# EAGLE schematic schema (EAGLE 9.4.2)
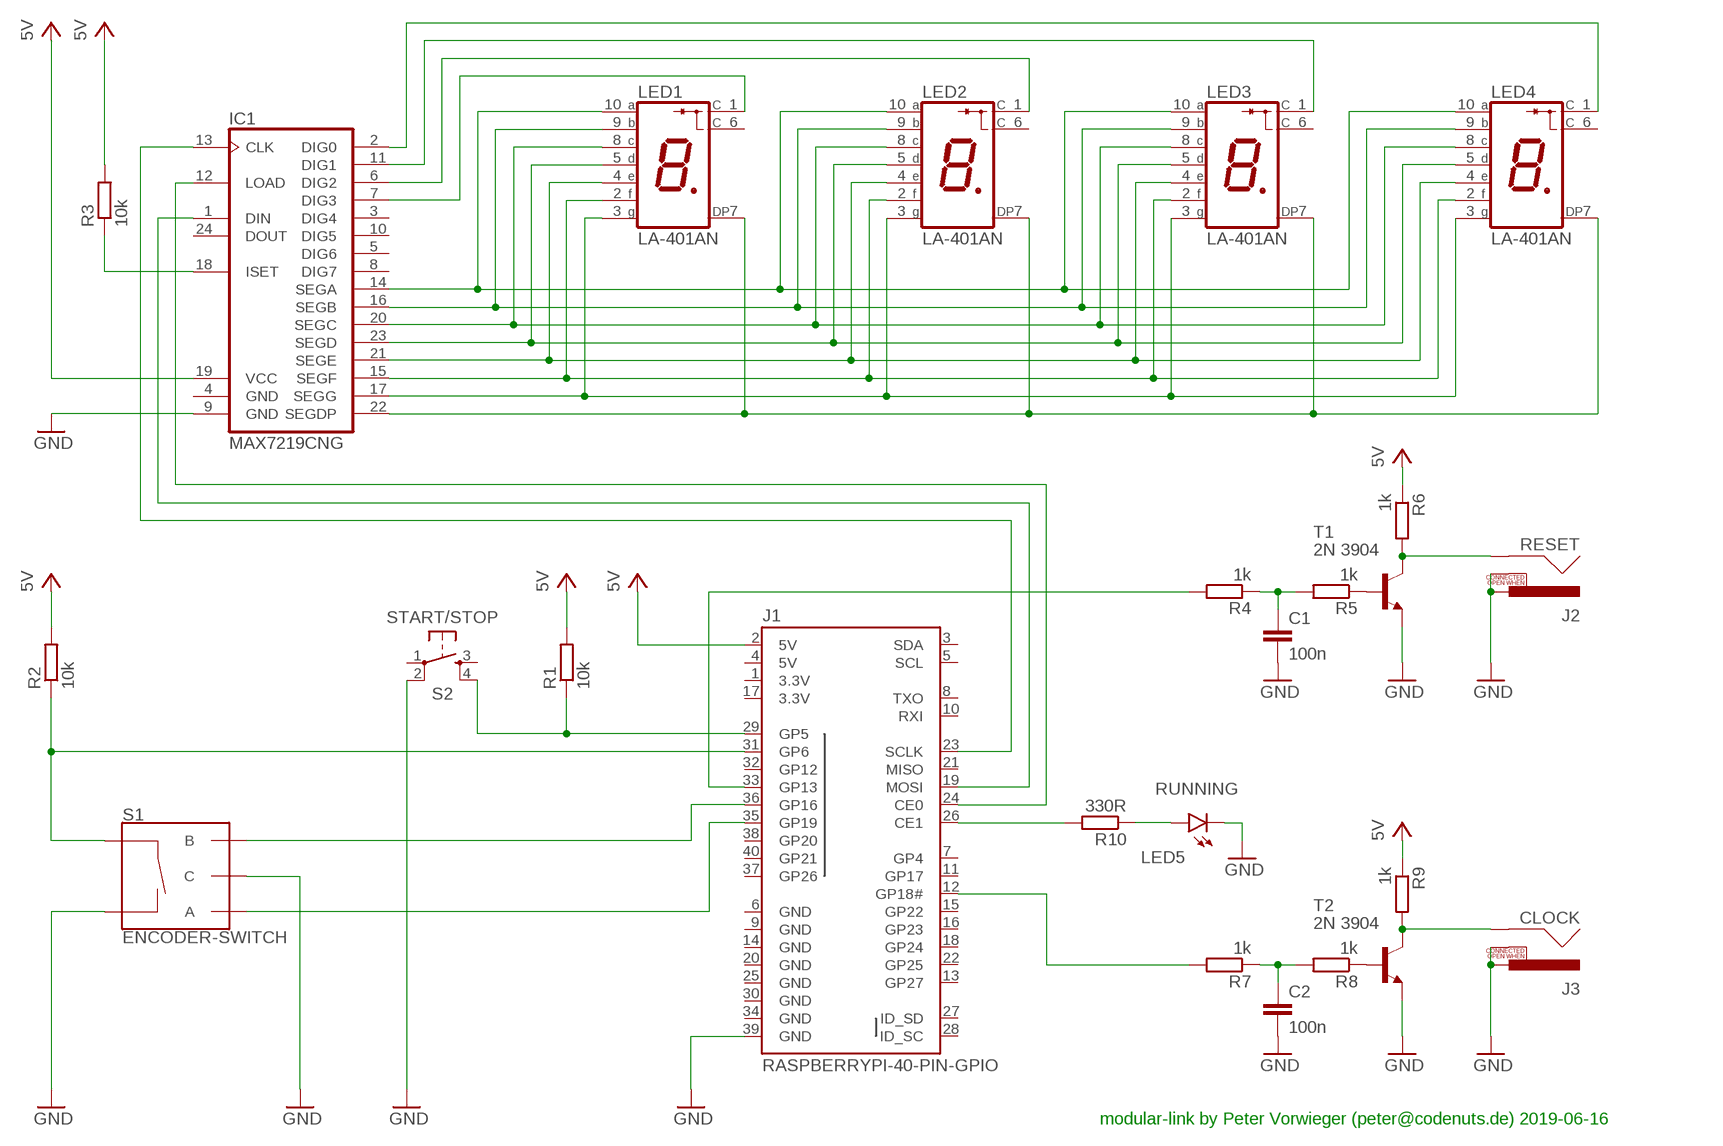
[diagram p0: schematic, sheet 1]

## Parts
C1  100n  C-EU025-024X044  [C025-024X044]
C2  100n  C-EU025-024X044  [C025-024X044]
IC1  MAX7219CNG  [DIL24-3]
J1  RASPBERRYPI-40-PIN-GPIO  RASPBERRYPI-40-PIN-GPIO_PTH_NO_SHROUD  [2X20]
J2  RESET  RCA  [RCA]
J3  CLOCK  RCA  [RCA]
LED1  LA-401AN  [LA-401]
LED2  LA-401AN  [LA-401]
LED3  LA-401AN  [LA-401]
LED4  LA-401AN  [LA-401]
LED5  RUNNING  LEDTOPLED-SANTANA  [MINI-TOPLED-SANTANA]
R1  10k  R-EU_0204/5  [0204/5]
R2  10k  R-EU_0204/5  [0204/5]
R3  10k  R-EU_0204/5  [0204/5]
R4  1k  R-EU_0204/5  [0204/5]
R5  1k  R-EU_0204/5  [0204/5]
R6  1k  R-EU_0204/5  [0204/5]
R7  1k  R-EU_0204/5  [0204/5]
R8  1k  R-EU_0204/5  [0204/5]
R9  1k  R-EU_0204/5  [0204/5]
R10  330R  R-EU_0204/5  [0204/5]
S1  ENCODER-SWITCH  [ROTARY_ENC_PLAIN]
S2  START/STOP  MOMENTARY-SWITCH-SPST-2-SMD-5.2MM  [TACTILE_SWITCH_SMD_5.2MM]
T1  2N 3904  -NPN-TO92-EBC  [TO92-EBC]
T2  2N 3904  -NPN-TO92-EBC  [TO92-EBC]

## Nets
GND: C1.2 C2.2 IC1.9(GND) J1.39(GND) J2.PIN J2.SWITCH J3.PIN J3.SWITCH LED5.C S1.C S1.SW- S2.2 T1.E T2.E
N$1: J1.31(GP6) R2.1 S1.SW+
N$2: IC1.14(SEGA) LED1.10(A) LED2.10(A) LED3.10(A) LED4.10(A)
N$3: IC1.16(SEGB) LED1.9(B) LED2.9(B) LED3.9(B) LED4.9(B)
N$4: IC1.20(SEGC) LED1.8(C) LED2.8(C) LED3.8(C) LED4.8(C)
N$5: IC1.23(SEGD) LED1.5(D) LED2.5(D) LED3.5(D) LED4.5(D)
N$6: IC1.22(SEGDP) LED1.7(DP) LED2.7(DP) LED3.7(DP) LED4.7(DP)
N$7: IC1.7(DIG3) LED1.1(C)
N$8: J1.35(GP19) S1.A
N$9: IC1.11(DIG1) LED3.1(C)
N$10: IC1.2(DIG0) LED4.1(C)
N$11: IC1.6(DIG2) LED2.1(C)
N$12: J1.29(GP5) R1.1 S2.4
N$13: IC1.21(SEGE) LED1.4(E) LED2.4(E) LED3.4(E) LED4.4(E)
N$14: IC1.15(SEGF) LED1.2(F) LED2.2(F) LED3.2(F) LED4.2(F)
N$15: J1.36(GP16) S1.B
N$16: J1.26(CE1) R10.2
N$17: IC1.17(SEGG) LED1.3(G) LED2.3(G) LED3.3(G) LED4.3(G)
N$18: IC1.18(ISET) R3.1
N$19: IC1.1(DIN) J1.19(MOSI)
N$20: IC1.12(LOAD) J1.24(CE0)
N$21: IC1.13(CLK) J1.23(SCLK)
N$22: J1.12(GP18#) R7.2
N$23: J1.33(GP13) R4.2
N$24: R5.1 T1.B
N$25: J2.SHELL R6.2 T1.C
N$26: C1.1 R4.1 R5.2
N$27: C2.1 R7.1 R8.2
N$28: R8.1 T2.B
N$29: J3.SHELL R9.2 T2.C
N$30: LED5.A R10.1
VCC: IC1.19(VCC) J1.2(5V) R1.2 R2.2 R3.2 R6.1 R9.1 ; supply symbol labelled 5V
Unconnected: IC1.3(DIG4) IC1.5(DIG6) IC1.8(DIG7) IC1.10(DIG5) IC1.24(DOUT) J1.3(SDA) J1.5(SCL) J1.7(GP4) J1.8(TXO) J1.10(RXI) J1.11(GP17) J1.13(GP27) J1.15(GP22) J1.16(GP23) J1.18(GP24) J1.21(MISO) J1.22(GP25) J1.27(ID_SD) J1.28(ID_SC) J1.32(GP12) J1.37(GP26) J1.38(GP20) J1.40(GP21) LED1.6(C) LED2.6(C) LED3.6(C) LED4.6(C) S2.1 S2.3

## Notes on the sheet
- modular-link by Peter Vorwieger (peter@codenuts.de) 2019-06-16

## Power pins joined to a net without a drawn wire
3.3V: J1.1(3.3V) J1.17(3.3V)
5V: J1.4(5V)
GND: IC1.4(GND) J1.6(GND) J1.9(GND) J1.14(GND) J1.20(GND) J1.25(GND) J1.30(GND) J1.34(GND)

## Library data of the parts
C1 C2 = rcl:C-EU: CAPACITOR, European symbol; SPICEPREFIX: C
IC1 = max7219:MAX7219CNG: LED DISPLAY DRIVER; MF: MAXIM; MPN: MAX7219CNG; OC_FARNELL: 1523914; OC_NEWARK: 34C4018
J1 = SparkFun-Connectors:RASPBERRYPI-40-PIN-GPIO: Raspberry Pi GPIO Header 2x20 pin connector, as found on B, B+, A+ models. Both shrouded PTH and SMT versions available. SparkFun Products: GPIO Shrouded Header <https://www.sparkfun.com/products/13054>- PTH SparkFun Pi Wedge (Preassembled) <https://www.sparkfun.com/products/13717>
J2 J3 = SparkFun-Connectors:RCA: RCA Jack connector This is a right angle RCA jack connecotr. Commonly used for video or audio. Here is the connector we sell at SparkFun: RCA Jack <https://www.sparkfun.com/products/8631> (PRT-08631) Datasheet <http://www.sparkfun.com/datasheets/Prototyping/Connectors/RCA-Jack.pdf> It is not used on any active designs, however it was used on a couple retired products: RCA Jack Breakout [RETIRED] <https://www.sparkfun.com/products/8826> (PRT-08826) SparkFun On Screen Display Breakout - MAX7456 [RETIRED] <https://www.sparkfun.com/products/9168> (BOB-09168) You may also be interested in a cable: RCA Video Cable - 6' <https://www.sparkfun.com/products/11573> (CAB-11573); PROD_ID: CONN-09081; SF_ID: PRT-08631
LED1-LED4 = led-7-segment:LA-401*N: Single Digit LED Numeric Display (cathode common) Source: ROHM .. la-1401dn.pdf; OC_FARNELL: unknown; OC_NEWARK: unknown
LED5 = led:LED: LED OSRAM: - CHIPLED LG R971, LG N971, LY N971, LG Q971, LY Q971, LO R971, LY R971 LH N974, LH R974 LS Q976, LO Q976, LY Q976 LO Q996 - Hyper CHIPLED LW Q18S LB Q993, LB Q99A, LB R99A - SideLED LS A670, LO A670, LY A670, LG A670, LP A670 LB A673, LV A673, LT A673, LW A673 LH A674 LY A675 LS A676, LA A676, LO A676, LY A676, LW A676 LS A679, LY A679, LG A679 - Hyper Micro SIDELED® LS Y876, LA Y876, LO Y876, LY Y876 LT Y87S - SmartLED LW L88C, LW L88S LB L89C, LB L89S, LG L890 LS L89K, LO L89K, LY L89K LS L896, LA L896, LO L896, LY L896 - TOPLED LS T670, LO T670, LY T670, LG T670, LP T670 LSG T670, LSP T670, LSY T670, LOP T670, LYG T670 LG T671, LOG T671, LSG T671 LB T673, LV T673, LT T673, LW T673 LH T674 LS T676, LA T676, LO T676, LY T676, LB T676, LH T676, LSB T676, LW T676 LB T67C, LV T67C, LT T67C, LS T67K, LO T67K, LY T67K, LW E67C LS E67B, LA E67B, LO E67B, LY E67B, LB E67C, LV E67C, LT E67C LW T67C LS T679, LY T679, LG T679 LS T770, LO T770, LY T770, LG T770, LP T770 LB T773, LV T773, LT T773, LW T773 LH T774 LS E675, LA E675, LY E675, LS T675 LS T776, LA T776, LO T776, LY T776, LB T776 LHGB T686 LT T68C, LB T68C - Hyper Mini TOPLED® LB M676 - Mini TOPLED Santana® LG M470 LS M47K, LO M47K, LY M47K Source: http://www.osram.convergy.de LUXEON: - LUMILED® LXK2-PW12-R00, LXK2-PW12-S00, LXK2-PW14-U00, LXK2-PW14-V00 LXK2-PM12-R00, LXK2-PM12-S00, LXK2-PM14-U00 LXK2-PE12-Q00, LXK2-PE12-R00, LXK2-PE12-S00, LXK2-PE14-T00, LXK2-PE14-U00 LXK2-PB12-K00, LXK2-PB12-L00, LXK2-PB12-M00, LXK2-PB14-N00, LXK2-PB14-P00, LXK2-PB14-Q00 LXK2-PR12-L00, LXK2-PR12-M00, LXK2-PR14-Q00, LXK2-PR14-R00 LXK2-PD12-Q00, LXK2-PD12-R00, LXK2-PD12-S00 LXK2-PH12-R00, LXK2-PH12-S00 LXK2-PL12-P00, LXK2-PL12-Q00, LXK2-PL12-R00 Source: www.luxeon.com KINGBRIGHT: KA-3528ASYC Source: www.kingbright.com
R1-R10 = rcl:R-EU_: RESISTOR, European symbol; SPICEPREFIX: R
S1 = SparkFun-Switches:ENCODER-SWITCH: Rotary Encoder w/ Select Switch Encoders rotate similarly to potentiometers, but they’re different from potentiometers in that an encoder has full rotation without limits. They output gray code so that you can tell how much and in which direction the encoder has been turned. This encoder includes a push-down select switch built into the shaft. SparkFun Products Rotary Encoder <https://www.sparkfun.com/products/9117> (COM-09117); SF_SKU: COM-09117
S2 = SparkFun-Switches:MOMENTARY-SWITCH-SPST-2: Momentary Switch (Pushbutton) - SPST - Two Circuits Normally-open (NO) SPST momentary switches (buttons, pushbuttons). Schematic symbol includes two switch circuits. Variants SMD-4.6MMX2.8MM - 4.60mm x 2.80mm Tactile Momentary Button Switch - Used on SparkFun SAMD21 Mini Breakout <https://www.sparkfun.com/products/13664> SMD-5.2MM - Mini Pushbutton Switch - SMD <https://www.sparkfun.com/products/8720> - Used on Arduino Pro Mini <https://www.sparkfun.com/products/11114>; PROD_ID: SWCH-08247; SF_SKU: COM-08720
T1 T2 = transistor:*-NPN-: NPN Transistror BF959 corrected 2008.03.06

## Net classes
0 default: clearance 0.205 mm